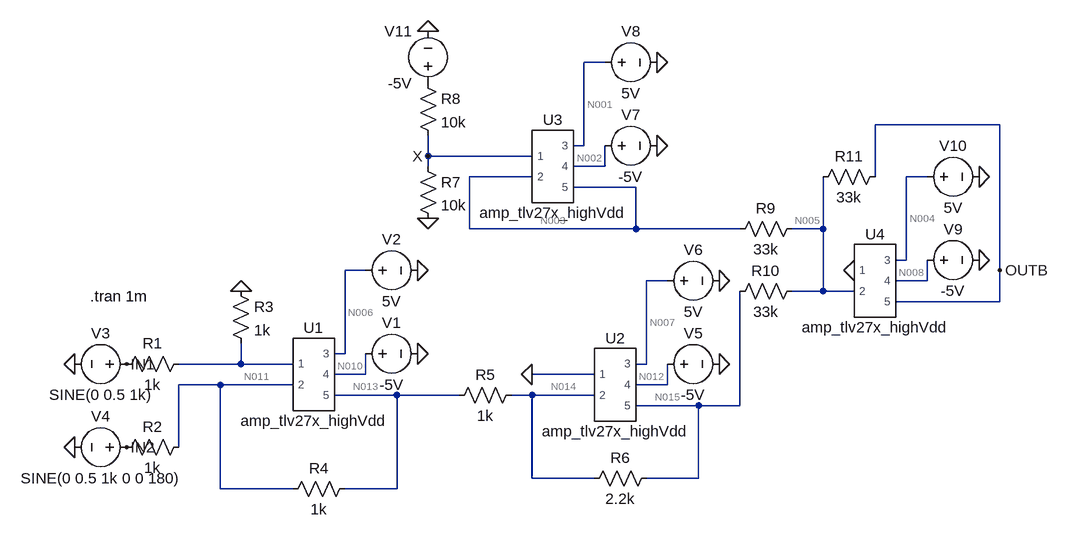
[diagram p0: schematic Pre-Lab-6-b.asc]
Pre-Lab-6-b.asc, the LTspice schematic file:
Version 4.1
SHEET 1 2260 876
WIRE 1056 -144 1024 -144
WIRE 1664 -48 1472 -48
WIRE 1024 -16 1024 -144
WIRE 1024 -16 1008 -16
WIRE 784 0 784 -32
WIRE 944 0 784 0
WIRE 784 16 784 0
WIRE 1056 16 1056 -16
WIRE 1056 16 1008 16
WIRE 944 32 848 32
WIRE 1472 32 1472 -48
WIRE 1552 32 1520 32
WIRE 1104 48 1008 48
WIRE 848 112 848 32
WIRE 1104 112 1104 48
WIRE 1104 112 848 112
WIRE 1264 112 1104 112
WIRE 1392 112 1392 32
WIRE 1392 112 1344 112
WIRE 1520 160 1520 32
WIRE 1520 160 1504 160
WIRE 688 176 656 176
WIRE 1664 176 1664 -48
WIRE 1152 192 1120 192
WIRE 1552 192 1552 160
WIRE 1552 192 1504 192
WIRE 1392 208 1392 112
WIRE 1392 208 1344 208
WIRE 1440 208 1392 208
WIRE 1664 224 1664 176
WIRE 1664 224 1504 224
WIRE 656 304 656 176
WIRE 656 304 640 304
WIRE 496 320 496 288
WIRE 496 320 400 320
WIRE 576 320 496 320
WIRE 1120 320 1120 192
WIRE 1120 320 1104 320
WIRE 688 336 688 304
WIRE 688 336 640 336
WIRE 1040 336 944 336
WIRE 464 352 400 352
WIRE 576 352 464 352
WIRE 1152 352 1152 320
WIRE 1152 352 1104 352
WIRE 736 368 640 368
WIRE 832 368 736 368
WIRE 944 368 912 368
WIRE 1040 368 944 368
WIRE 1200 384 1104 384
WIRE 1264 384 1264 208
WIRE 1264 384 1200 384
WIRE 400 448 400 352
WIRE 944 496 944 368
WIRE 1040 496 944 496
WIRE 1200 496 1200 384
WIRE 1200 496 1120 496
WIRE 464 512 464 352
WIRE 576 512 464 512
WIRE 736 512 736 368
WIRE 736 512 656 512
FLAG 768 176 0
FLAG 768 304 0
FLAG 240 320 0
FLAG 240 448 0
FLAG 320 448 IN2
FLAG 320 320 IN1
FLAG 496 208 0
FLAG 1232 192 0
FLAG 1232 320 0
FLAG 1136 -144 0
FLAG 1136 -16 0
FLAG 1632 32 0
FLAG 1632 160 0
FLAG 944 336 0
FLAG 784 -192 0
FLAG 784 96 0
FLAG 784 0 X
FLAG 1664 176 OUTB
FLAG 1440 176 0
SYMBOL amp_tlv27x_highVdd1 608 336 R0
SYMATTR InstName U1
SYMBOL res 416 304 R90
WINDOW 0 0 56 VBottom 2
WINDOW 3 32 56 VTop 2
SYMATTR InstName R1
SYMATTR Value 1k
SYMBOL res 416 432 R90
WINDOW 0 0 56 VBottom 2
WINDOW 3 32 56 VTop 2
SYMATTR InstName R2
SYMATTR Value 1k
SYMBOL res 480 192 R0
SYMATTR InstName R3
SYMATTR Value 1k
SYMBOL res 672 496 R90
WINDOW 0 0 56 VBottom 2
WINDOW 3 32 56 VTop 2
SYMATTR InstName R4
SYMATTR Value 1k
SYMBOL voltage 672 304 R270
WINDOW 0 32 56 VTop 2
WINDOW 3 -32 56 VBottom 2
WINDOW 123 0 0 Left 0
WINDOW 39 0 0 Left 0
SYMATTR InstName V1
SYMATTR Value -5V
SYMBOL voltage 672 176 R270
WINDOW 0 32 56 VTop 2
WINDOW 3 -32 56 VBottom 2
WINDOW 123 0 0 Left 0
WINDOW 39 0 0 Left 0
SYMATTR InstName V2
SYMATTR Value 5V
SYMBOL voltage 336 320 R90
WINDOW 0 -32 56 VBottom 2
WINDOW 3 32 56 VTop 2
WINDOW 123 0 0 Left 0
WINDOW 39 0 0 Left 0
SYMATTR InstName V3
SYMATTR Value SINE(0 0.5 1k)
SYMBOL voltage 336 448 R90
WINDOW 0 -32 56 VBottom 2
WINDOW 3 32 56 VTop 2
WINDOW 123 0 0 Left 0
WINDOW 39 0 0 Left 0
SYMATTR InstName V4
SYMATTR Value SINE(0 0.5 1k 0 0 180)
SYMBOL amp_tlv27x_highVdd1 1072 352 R0
SYMATTR InstName U2
SYMBOL voltage 1136 320 R270
WINDOW 0 32 56 VTop 2
WINDOW 3 -32 56 VBottom 2
WINDOW 123 0 0 Left 0
WINDOW 39 0 0 Left 0
SYMATTR InstName V5
SYMATTR Value -5V
SYMBOL voltage 1136 192 R270
WINDOW 0 32 56 VTop 2
WINDOW 3 -32 56 VBottom 2
WINDOW 123 0 0 Left 0
WINDOW 39 0 0 Left 0
SYMATTR InstName V6
SYMATTR Value 5V
SYMBOL amp_tlv27x_highVdd1 976 16 R0
SYMATTR InstName U3
SYMBOL voltage 1040 -16 R270
WINDOW 0 32 56 VTop 2
WINDOW 3 -32 56 VBottom 2
WINDOW 123 0 0 Left 0
WINDOW 39 0 0 Left 0
SYMATTR InstName V7
SYMATTR Value -5V
SYMBOL voltage 1040 -144 R270
WINDOW 0 32 56 VTop 2
WINDOW 3 -32 56 VBottom 2
WINDOW 123 0 0 Left 0
WINDOW 39 0 0 Left 0
SYMATTR InstName V8
SYMATTR Value 5V
SYMBOL amp_tlv27x_highVdd1 1472 192 R0
SYMATTR InstName U4
SYMBOL voltage 1536 160 R270
WINDOW 0 32 56 VTop 2
WINDOW 3 -32 56 VBottom 2
WINDOW 123 0 0 Left 0
WINDOW 39 0 0 Left 0
SYMATTR InstName V9
SYMATTR Value -5V
SYMBOL voltage 1536 32 R270
WINDOW 0 32 56 VTop 2
WINDOW 3 -32 56 VBottom 2
WINDOW 123 0 0 Left 0
WINDOW 39 0 0 Left 0
SYMATTR InstName V10
SYMATTR Value 5V
SYMBOL res 928 352 R90
WINDOW 0 0 56 VBottom 2
WINDOW 3 32 56 VTop 2
SYMATTR InstName R5
SYMATTR Value 1k
SYMBOL res 1136 480 R90
WINDOW 0 0 56 VBottom 2
WINDOW 3 32 56 VTop 2
SYMATTR InstName R6
SYMATTR Value 2.2k
SYMBOL res 768 0 R0
SYMATTR InstName R7
SYMATTR Value 10k
SYMBOL res 768 -128 R0
SYMATTR InstName R8
SYMATTR Value 10k
SYMBOL voltage 784 -96 R180
WINDOW 0 24 96 Left 2
WINDOW 3 24 16 Left 2
WINDOW 123 0 0 Left 0
WINDOW 39 0 0 Left 0
SYMATTR InstName V11
SYMATTR Value -5V
SYMBOL res 1360 96 R90
WINDOW 0 0 56 VBottom 2
WINDOW 3 32 56 VTop 2
SYMATTR InstName R9
SYMATTR Value 33k
SYMBOL res 1360 192 R90
WINDOW 0 0 56 VBottom 2
WINDOW 3 32 56 VTop 2
SYMATTR InstName R10
SYMATTR Value 33k
SYMBOL res 1488 16 R90
WINDOW 0 0 56 VBottom 2
WINDOW 3 32 56 VTop 2
SYMATTR InstName R11
SYMATTR Value 33k
TEXT 264 216 Left 2 !.tran 1m

The netlist it stands for:
* Pre-Lab-6-b.asc
X§U1 N009 N011 N006 N010 N013 amp_tlv27x_highVdd  ; pins 1 2 3 4 5
R1 N009 IN1 1k
R2 N011 IN2 1k
R3 0 N009 1k
R4 N013 N011 1k
V1 N010 0 -5V
V2 N006 0 5V
V3 IN1 0 SINE(0 0.5 1k)
V4 IN2 0 SINE(0 0.5 1k 0 0 180)
X§U2 0 N014 N007 N012 N015 amp_tlv27x_highVdd  ; pins 1 2 3 4 5
V5 N012 0 -5V
V6 N007 0 5V
X§U3 X N003 N001 N002 N003 amp_tlv27x_highVdd  ; pins 1 2 3 4 5
V7 N002 0 -5V
V8 N001 0 5V
X§U4 0 N005 N004 N008 OUTB amp_tlv27x_highVdd  ; pins 1 2 3 4 5
V9 N008 0 -5V
V10 N004 0 5V
R5 N014 N013 1k
R6 N015 N014 2.2k
R7 X 0 10k
R8 P001 X 10k
V11 P001 0 -5V
R9 N005 N003 33k
R10 N005 N015 33k
R11 OUTB N005 33k
.tran 1m
.lib TLV271.LIB
.backanno
.end

* Results of the author's LTspice run, read from the files saved beside the schematic
* Operating Point, zero values left out:
*   V(n001) = 5 V
*   V(n002) = -5 V
*   V(n003) = -2.499 V
*   V(n004) = 5 V
*   V(n005) = -342 µV
*   V(n006) = 5 V
*   V(n007) = 5 V
*   V(n008) = -5 V
*   V(n010) = -5 V
*   V(n011) = -280.4 µV
*   V(n012) = -5 V
*   V(n013) = -560.8 µV
*   V(n014) = -280.4 µV
*   V(n015) = 336.4 µV
*   V(outb) = 2.498 V
*   V(p001) = -5 V
*   V(x) = -2.5 V
*   I(R1) = 3.45 pA
*   I(R10) = -20.56 nA
*   I(R11) = 75.71 µA
*   I(R2) = -280.4 nA
*   I(R3) = -3.45 pA
*   I(R4) = -280.4 nA
*   I(R5) = 280.4 nA
*   I(R6) = 280.4 nA
*   I(R7) = -250 µA
*   I(R8) = -250 µA
*   I(R9) = 75.73 µA
*   I(V1) = 67.78 µA
*   I(V10) = -67.78 µA
*   I(V11) = 250 µA
*   I(V2) = -67.78 µA
*   I(V3) = 3.45 pA
*   I(V4) = -280.4 nA
*   I(V5) = 67.78 µA
*   I(V6) = -67.78 µA
*   I(V7) = 67.78 µA
*   I(V8) = -67.77 µA
*   I(V9) = 67.78 µA
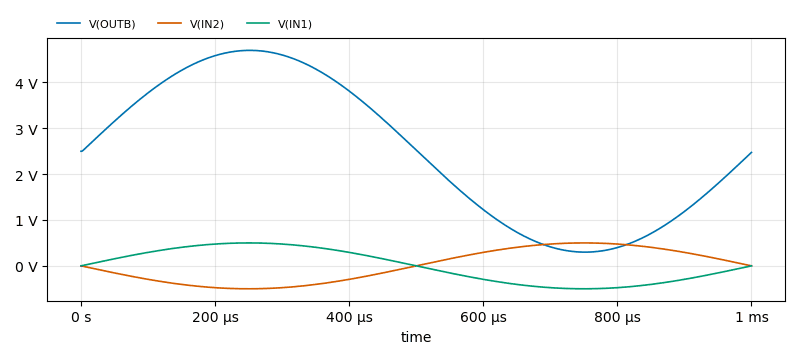
[diagram p1: Transient Analysis of Pre-Lab-6-b.asc, plotted from the saved traces]
* Transient Analysis, 1 run:
*   V(OUTB): min 298.9 mV, max 4.697 V, average 2.498 V, rms 2.943 V, last 2.473 V
*   V(IN2): min -500 mV, max 500 mV, average 0 V, rms 353.6 mV, last 0 V
*   V(IN1): min -500 mV, max 500 mV, average 0 V, rms 353.6 mV, last 0 V